# EAGLE design IVPSU (EAGLE 5.07)
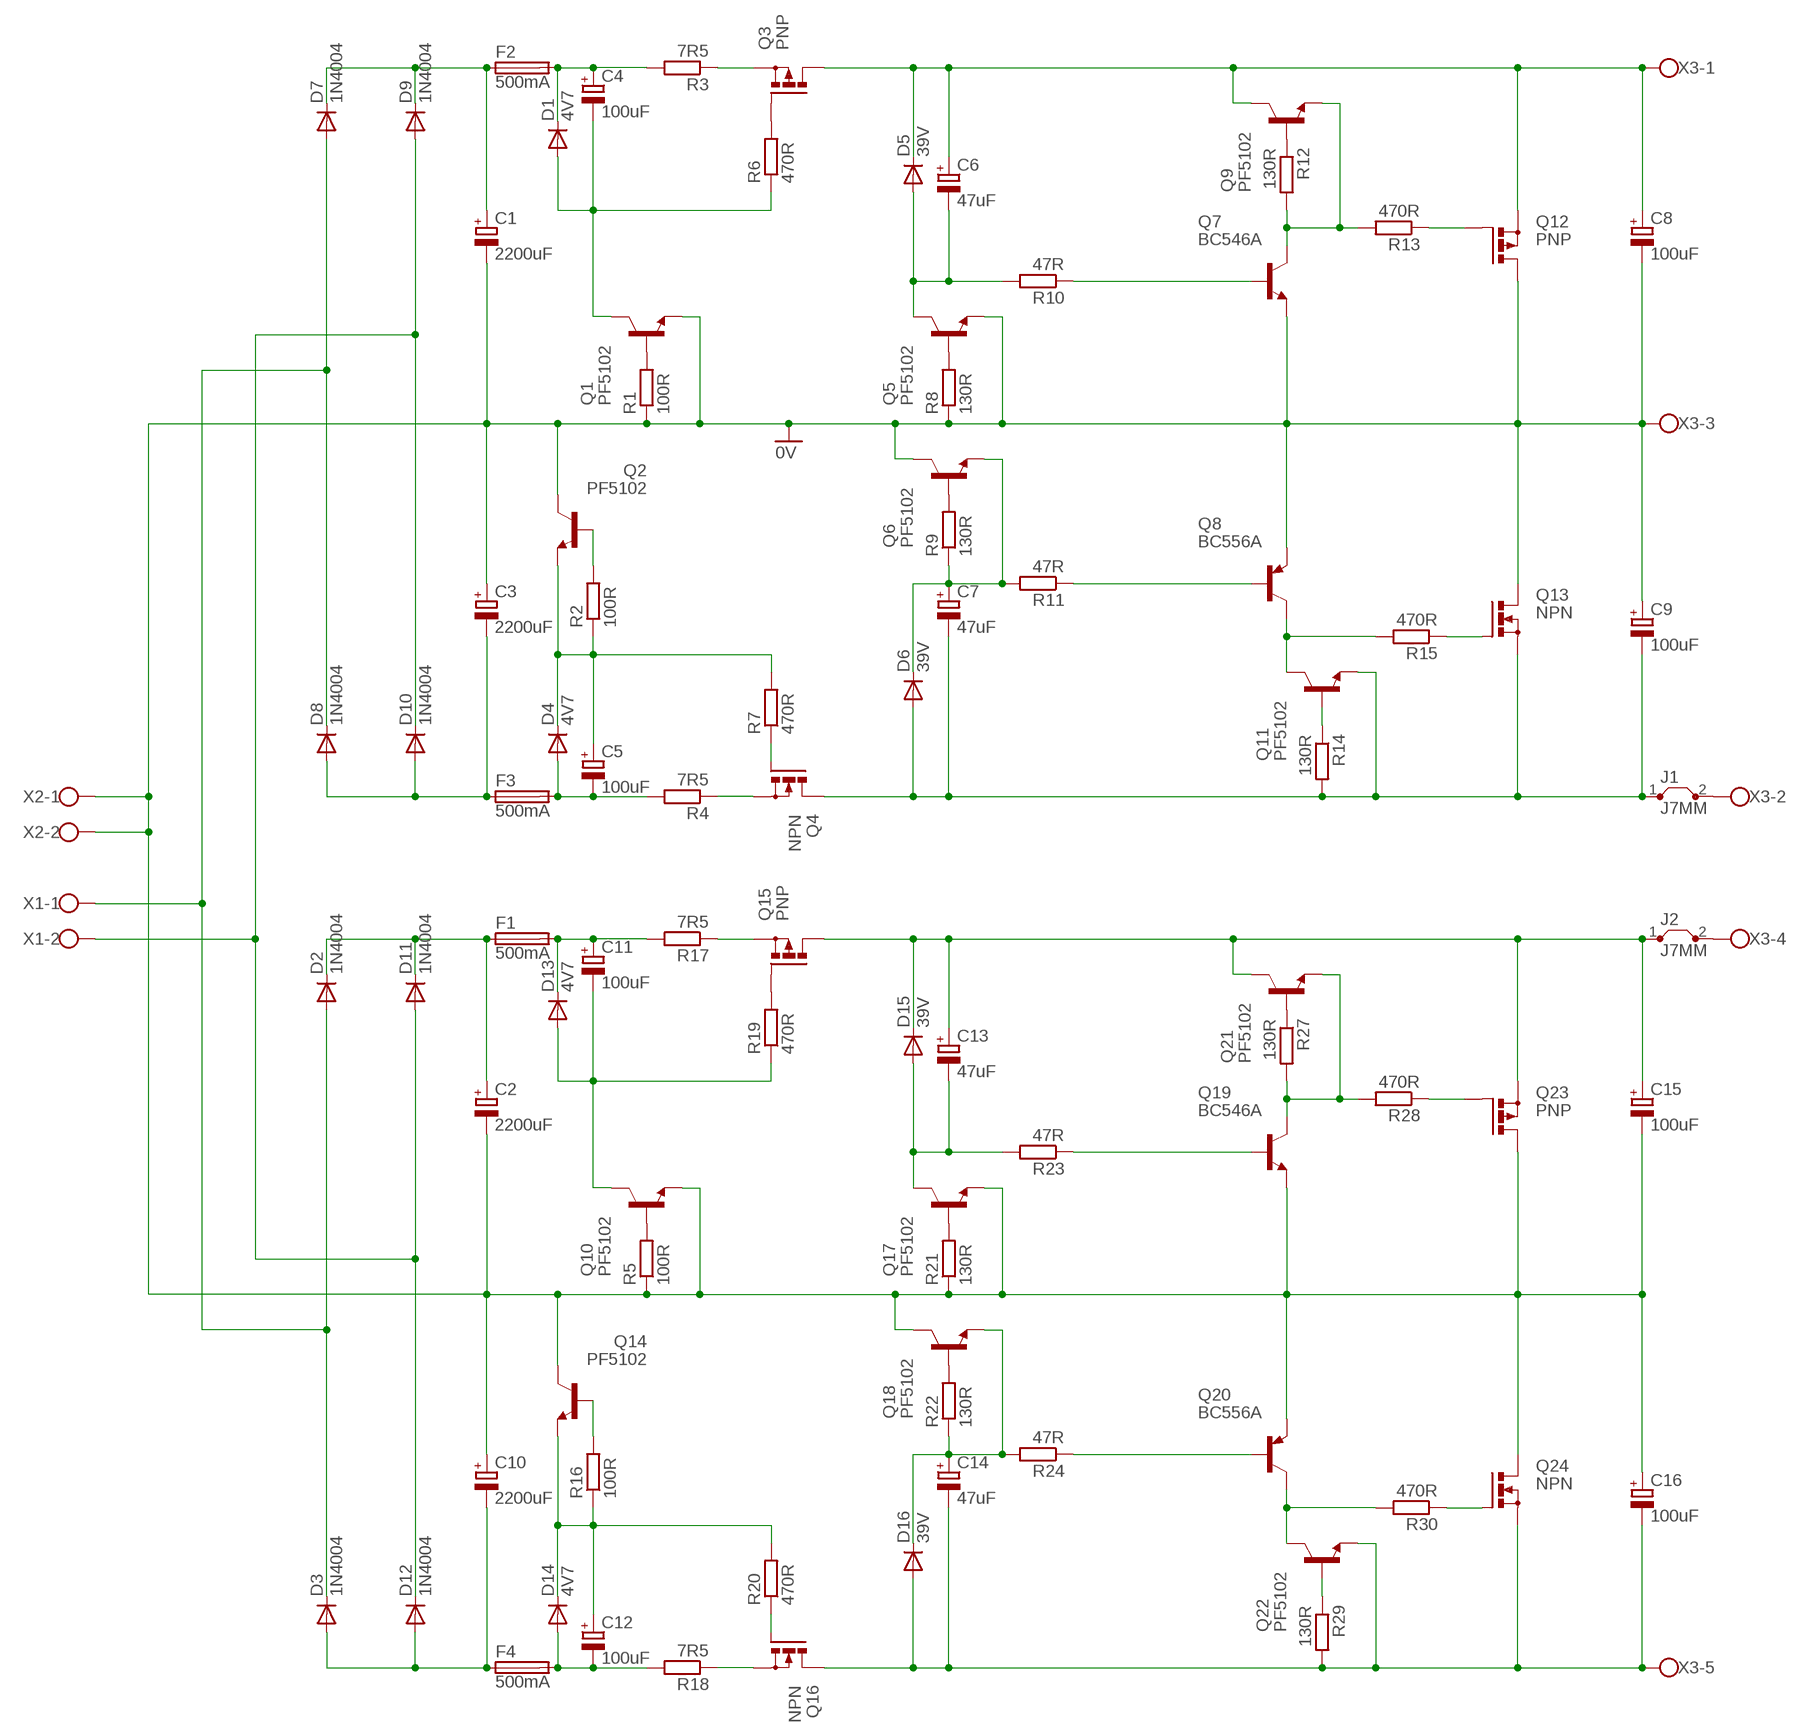
[diagram p0: schematic, sheet 1]

## Parts
C1  2200uF  CPOL-EUE7.5-18  [E7,5-18]
C2  2200uF  CPOL-EUE7.5-18  [E7,5-18]
C3  2200uF  CPOL-EUE7.5-18  [E7,5-18]
C4  100uF  CPOL-EUE3.5-8  [E3,5-8]
C5  100uF  CPOL-EUE3.5-8  [E3,5-8]
C6  47uF  CPOL-EUE3.5-8  [E3,5-8]
C7  47uF  CPOL-EUE3.5-8  [E3,5-8]
C8  100uF  CPOL-EUE5-8.5  [E5-8,5]
C9  100uF  CPOL-EUE5-8.5  [E5-8,5]
C10  2200uF  CPOL-EUE7.5-18  [E7,5-18]
C11  100uF  CPOL-EUE3.5-8  [E3,5-8]
C12  100uF  CPOL-EUE3.5-8  [E3,5-8]
C13  47uF  CPOL-EUE3.5-8  [E3,5-8]
C14  47uF  CPOL-EUE3.5-8  [E3,5-8]
C15  100uF  CPOL-EUE5-8.5  [E5-8,5]
C16  100uF  CPOL-EUE5-8.5  [E5-8,5]
D1  4V7  1N4004  [DO41-10]
D2  1N4004  [DO41-10]
D3  1N4004  [DO41-10]
D4  4V7  1N4004  [DO41-10]
D5  39V  1N4004  [DO41-10]
D6  39V  1N4004  [DO41-10]
D7  1N4004  [DO41-10]
D8  1N4004  [DO41-10]
D9  1N4004  [DO41-10]
D10  1N4004  [DO41-10]
D11  1N4004  [DO41-10]
D12  1N4004  [DO41-10]
D13  4V7  1N4004  [DO41-10]
D14  4V7  1N4004  [DO41-10]
D15  39V  1N4004  [DO41-10]
D16  39V  1N4004  [DO41-10]
F1  500mA  19560  [19560]
F2  500mA  19560  [19560]
F3  500mA  19560  [19560]
F4  500mA  19560  [19560]
J1  J7MM  [07]
J2  J7MM  [07]
Q1  PF5102  BCX59SMD  [TO92-EBC]
Q2  PF5102  BCX59SMD  [TO92-EBC]
Q3  PNP  PMOSFET_PTO220BH  [TO220BH]
Q4  NPN  PMOSFET_NTO220BH  [TO220BH]
Q5  PF5102  BCX59SMD  [TO92-EBC]
Q6  PF5102  BCX59SMD  [TO92-EBC]
Q7  BC546A  BC550B  [TO92-EBC]
Q8  BC556A  BC560  [TO92-EBC]
Q9  PF5102  BCX59SMD  [TO92-EBC]
Q10  PF5102  BCX59SMD  [TO92-EBC]
Q11  PF5102  BCX59SMD  [TO92-EBC]
Q12  PNP  PMOSFET_PTO220BH  [TO220BH]
Q13  NPN  PMOSFET_NTO220BH  [TO220BH]
Q14  PF5102  BCX59SMD  [TO92-EBC]
Q15  PNP  PMOSFET_PTO220BH  [TO220BH]
Q16  NPN  PMOSFET_NTO220BH  [TO220BH]
Q17  PF5102  BCX59SMD  [TO92-EBC]
Q18  PF5102  BCX59SMD  [TO92-EBC]
Q19  BC546A  BC550B  [TO92-EBC]
Q20  BC556A  BC560  [TO92-EBC]
Q21  PF5102  BCX59SMD  [TO92-EBC]
Q22  PF5102  BCX59SMD  [TO92-EBC]
Q23  PNP  PMOSFET_PTO220BH  [TO220BH]
Q24  NPN  PMOSFET_NTO220BH  [TO220BH]
R1  100R  R-EU_0204/7  [0204/7]
R2  100R  R-EU_0204/7  [0204/7]
R3  7R5  R-EU_0309/12  [0309/12]
R4  7R5  R-EU_0309/12  [0309/12]
R5  100R  R-EU_0204/7  [0204/7]
R6  470R  R-EU_0204/7  [0204/7]
R7  470R  R-EU_0204/7  [0204/7]
R8  130R  R-EU_0204/7  [0204/7]
R9  130R  R-EU_0204/7  [0204/7]
R10  47R  R-EU_0204/7  [0204/7]
R11  47R  R-EU_0204/7  [0204/7]
R12  130R  R-EU_0204/7  [0204/7]
R13  470R  R-EU_0204/7  [0204/7]
R14  130R  R-EU_0204/7  [0204/7]
R15  470R  R-EU_0204/7  [0204/7]
R16  100R  R-EU_0204/7  [0204/7]
R17  7R5  R-EU_0309/12  [0309/12]
R18  7R5  R-EU_0309/12  [0309/12]
R19  470R  R-EU_0204/7  [0204/7]
R20  470R  R-EU_0204/7  [0204/7]
R21  130R  R-EU_0204/7  [0204/7]
R22  130R  R-EU_0204/7  [0204/7]
R23  47R  R-EU_0204/7  [0204/7]
R24  47R  R-EU_0204/7  [0204/7]
R27  130R  R-EU_0204/7  [0204/7]
R28  470R  R-EU_0204/7  [0204/7]
R29  130R  R-EU_0204/7  [0204/7]
R30  470R  R-EU_0204/7  [0204/7]
X1  W237-02P  [W237-132]
X2  W237-02P  [W237-132]
X3  W237-05P  [W237-5P]

## Nets
0V: C1.- C2.- C3.+ C8.- C9.+ C10.+ C15.- C16.+ Q1.E Q2.C Q5.E Q6.C Q7.E Q8.E Q10.E Q12.D Q13.D Q14.C Q17.E Q18.C Q19.E Q20.E Q23.D Q24.D R1.1 R5.1 R8.1 R21.1 X2.1 X2.2 X3.3
N$1: J1.2 X3.2
N$2: D2.A D3.C D7.A D8.C X1.1
N$3: C11.- D13.A Q10.C R19.1
N$4: C2.+ D2.C D11.C F1.1
N$5: C10.- D3.A D12.A F4.1
N$6: D9.A D10.C D11.A D12.C X1.2
N$7: J2.2 X3.4
N$8: C1.+ D7.C D9.C F2.1
N$9: C5.+ D4.C Q2.E R2.1 R7.2
N$10: Q2.B R2.2
N$11: Q3.S R3.1
N$12: Q4.S R4.1
N$13: C5.- D4.A F3.2 R4.2
N$14: Q1.B R1.2
N$15: C4.+ D1.C F2.2 R3.2
N$16: Q3.G R6.2
N$17: Q4.G R7.1
N$18: C4.- D1.A Q1.C R6.1
N$19: C6.- D5.A Q5.C R10.2
N$20: C7.+ D6.C Q6.E R9.1 R11.2
N$21: Q5.B R8.2
N$22: Q6.B R9.2
N$23: C7.- C9.- D6.A J1.1 Q4.D Q11.E Q13.S R14.2
N$24: Q8.C Q11.C R15.2
N$25: Q12.G R13.1
N$26: C6.+ C8.+ D5.C Q3.D Q9.C Q12.S X3.1
N$27: C14.- C16.- D16.A Q16.D Q22.E Q24.S R29.2 X3.5
N$28: C12.+ D14.C Q14.E R16.1 R20.2
N$29: Q14.B R16.2
N$30: Q9.B R12.1
N$31: Q7.C Q9.E R12.2 R13.2
N$32: Q11.B R14.1
N$34: Q15.S R17.1
N$35: Q16.S R18.1
N$36: C13.- D15.A Q17.C R23.2
N$37: C12.- D14.A F4.2 R18.2
N$38: Q19.B R23.1
N$39: Q10.B R5.2
N$40: C11.+ D13.C F1.2 R17.2
N$41: C14.+ D16.C Q18.E R22.1 R24.2
N$42: Q20.B R24.1
N$43: Q7.B R10.1
N$44: Q24.G R30.1
N$45: Q15.G R19.2
N$46: Q16.G R20.1
N$47: Q8.B R11.1
N$48: Q17.B R21.2
N$49: Q18.B R22.2
N$50: Q13.G R15.1
N$51: Q20.C Q22.C R30.2
N$52: Q23.G R28.1
N$53: C13.+ C15.+ D15.C J2.1 Q15.D Q21.C Q23.S
N$54: Q21.B R27.1
N$55: Q19.C Q21.E R27.2 R28.2
N$56: Q22.B R29.1
N$60: C3.- D8.A D10.A F3.1

## Library data of the parts
C1-C16 = resistor:CPOL-EU: POLARIZED CAPACITOR, European symbol
D1-D16 = diode:1N4004: DIODE general purpose rectifier, 1 A
F1-F4 = fuse:19560: FUSE HOLDER TR5, Wickmann
J1 J2 = jumper:J: Bridge
Q1 Q2 Q5 Q6 Q9-Q11 Q14 Q17 Q18 Q21 Q22 = transistor-npn:BCX59*: NPN Transistor
Q3 Q12 Q15 Q23 = transistor-power:PMOSFET_P: Power MOSFET P-Channel
Q4 Q13 Q16 Q24 = transistor-power:PMOSFET_N: Power MOSFET N-Channel
Q7 Q19 = transistor-npn:BC550*: NPN Transistor
Q8 Q20 = transistor-pnp:BC560*: PNP Transistror
R1-R24 R27-R30 = resistor:R-EU_: RESISTOR, European symbol
X1 X2 = con-wago-508:W237-02P: WAGO SREW CLAMP
X3 = con-wago-508:W237-05P: WAGO SREW CLAMP

## Board
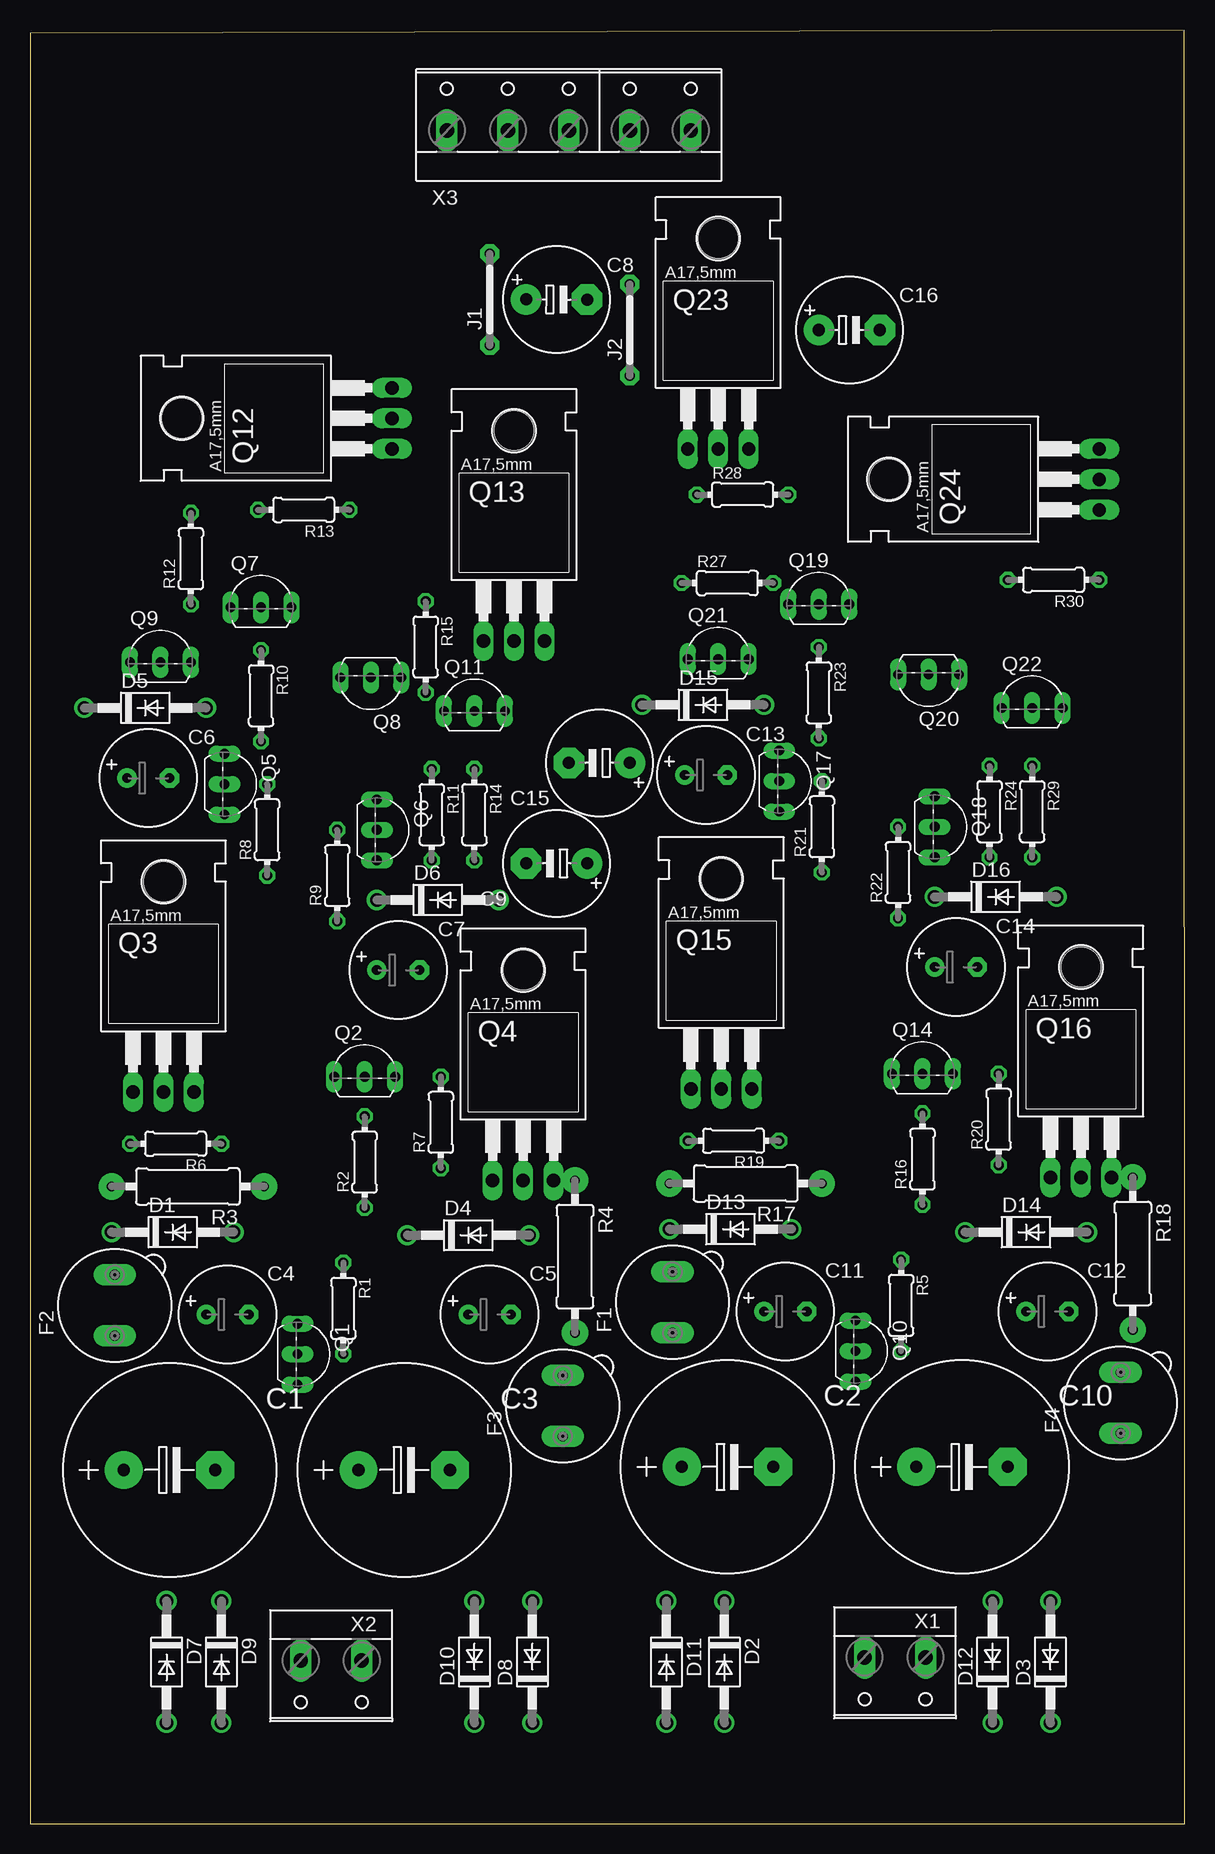
[diagram p1: board, top side]
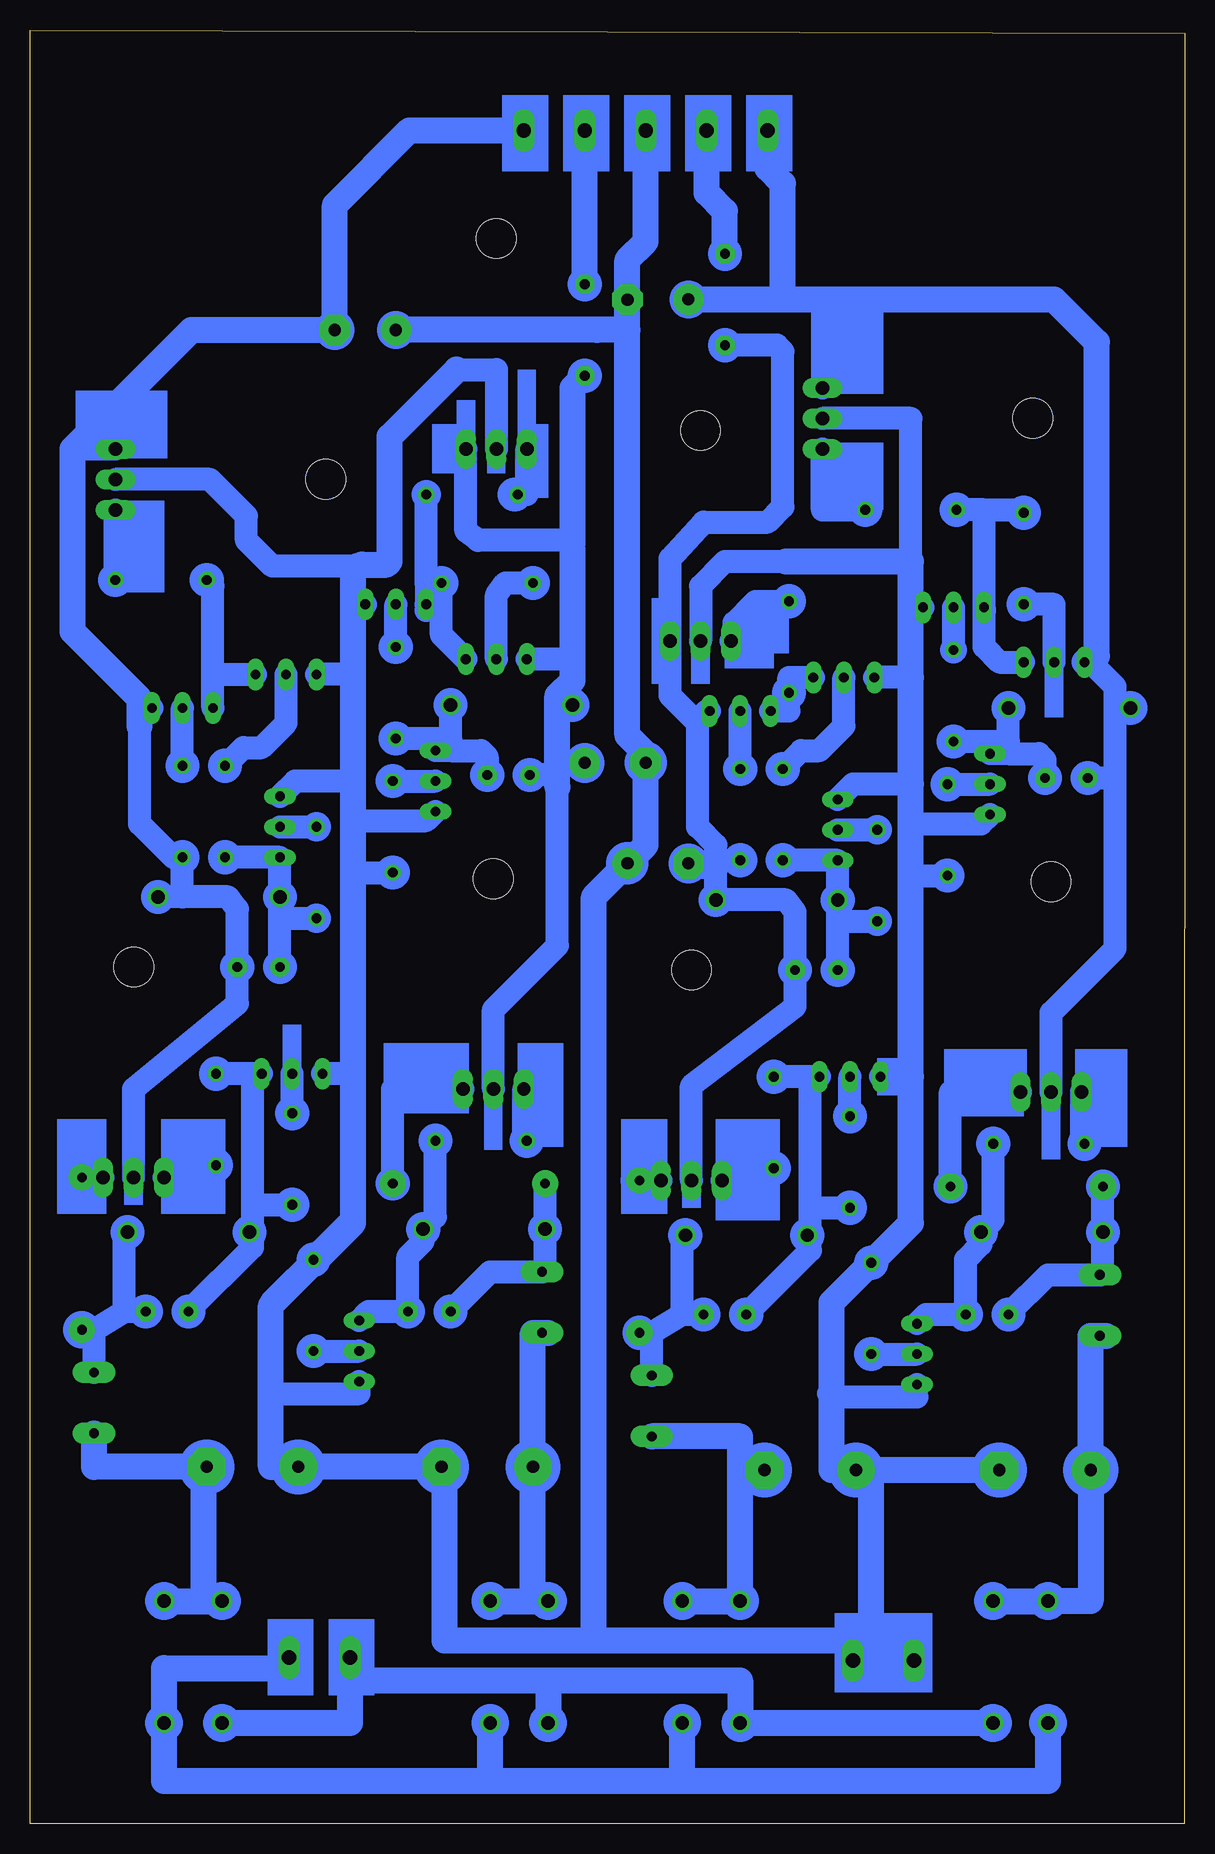
[diagram p2: board, bottom side, seen from below]

Size 96.22 x 149.46 mm. Coordinates in mm from the lower left corner, seen from the top.
Outline: 96.22,0 96.19,149.46 0,149.21 0.03,0 96.22,0
Copper layers (1*16): Top 0.035mm / dielectric 1.5mm / Bottom 0.035mm
Design rules "default": minimum track width 10mil, minimum drill 24mil, track to track 8mil, track to pad 8mil, pad to pad 8mil, via to via 8mil, smd to smd 8mil, copper to edge 40mil, drill to drill 8mil, minimum pad ring 10mil, minimum via ring 8mil, stop-mask expansion 4mil, vias tented up to drill 0mil, thermal gap 10mil

### Footprints (pad centres in the part's own frame; a part is rotated, then mirrored left to right if it is on the bottom)
E7,5-18 = drill 1.016 pad 3.15 round: + -3.81,0 | drill 1.016 pad 3.15 octagon: - 3.81,0
E3,5-8 = drill 0.813 pad 1.6 round: + -1.778,0 | drill 0.813 pad 1.6 octagon: - 1.778,0
E5-8,5 = drill 1.016 pad 2.54 round: + -2.54,0 | drill 1.016 pad 2.54 octagon: - 2.54,0
DO41-10 = drill 1.118 round: A 5.08,0; C -5.08,0
19560 = drill 0.813 pad 1.778 long: 1 -2.54,0; 2 2.54,0
07 = drill 0.813 pad 1.6 octagon: 1 -3.81,0; 2 3.81,0
TO92-EBC = drill 0.813 long: B 0,-1.27; C -2.54,-1.27; E 2.54,-1.27
TO220BH = drill 1.118 long: D 0,-6.35; G -2.54,-6.35; S 2.54,-6.35 | hole 3.302: 0,11.176
0204/7 = drill 0.813 octagon: 1 -3.81,0; 2 3.81,0
0309/12 = drill 0.8 pad 2.184 round: 1 -6.35,0; 2 6.35,0
W237-132 = drill 1.194 long: 1 -2.54,-0.635; 2 2.54,-0.635
W237-5P = drill 1.194 long: 1 -10.16,-0.635; 2 -5.08,-0.635; 3 0,-0.635; 4 5.08,-0.635; 5 10.16,-0.635

### Placement (x,y rotation side)
C1  11.63,29.46 0 top
C2  58.12,29.72 0 top
C3  31.19,29.46 0 top
C4  16.46,42.42 0 top
C5  38.3,42.42 0 top
C6  9.86,87.12 0 top
C7  30.68,71.12 0 top
C8  43.89,127 359.7 top
C9  43.89,80.01 180 top
C10  77.67,29.72 0 top
C11  62.94,42.67 0 top
C12  84.79,42.67 0 top
C13  56.34,87.38 0 top
C14  77.17,71.37 0 top
C15  47.45,88.39 180 top
C16  68.28,124.46 0 top
D1  11.89,49.28 0 top
D2  57.86,13.46 270 top
D3  85.04,13.46 90 top
D4  36.53,49.02 0 top
D5  9.6,92.96 0 top
D6  33.99,76.96 0 top
D7  11.38,13.46 270 top
D8  41.86,13.46 90 top
D9  15.95,13.46 270 top
D10  37.03,13.46 90 top
D11  53.04,13.46 270 top
D12  80.21,13.46 90 top
D13  58.37,49.53 0 top
D14  83.01,49.28 0 top
D15  56.08,93.22 0 top
D16  80.47,77.22 0 top
F1  53.54,43.43 90 top
F2  7.06,43.18 90 top
F3  44.4,34.8 90 top
F4  90.88,35.05 90 top
J1  38.3,127 90 top
J2  49.99,124.46 90 top
Q1  23.57,39.12 270 top
Q2  27.89,63.5 0 top
Q3  11.13,67.31 0 top
Q4  41.1,59.94 0 top
Q5  17.48,86.61 270 top
Q6  30.18,82.8 270 top
Q7  19.25,102.62 0 top
Q8  28.4,94.23 180 top
Q9  10.87,98.04 0 top
Q10  70.05,39.37 270 top
Q11  37.03,93.98 0 top
Q12  23.83,117.09 90 top
Q13  40.34,104.9 0 top
Q14  74.37,63.75 0 top
Q15  57.61,67.56 0 top
Q16  87.58,60.2 0 top
Q17  63.7,86.87 270 top
Q18  76.66,83.06 270 top
Q19  65.74,102.87 0 top
Q20  74.88,94.49 180 top
Q21  57.35,98.3 0 top
Q22  83.52,94.23 0 top
Q23  57.35,120.9 0 top
Q24  82.75,112.01 90 top
R1  26.11,42.93 270 top
R2  27.89,55.12 90 top
R3  13.16,53.09 180 top
R4  45.42,47.24 270 top
R5  72.59,43.18 270 top
R6  12.14,56.64 180 top
R7  34.24,58.42 90 top
R8  19.76,82.8 90 top
R9  25.6,78.99 90 top
R10  19.25,93.98 270 top
R11  33.48,84.07 270 top
R12  13.41,105.41 90 top
R13  22.81,109.47 180 top
R14  37.03,84.07 270 top
R15  32.97,98.04 270 top
R16  74.37,55.37 90 top
R17  59.64,53.34 180 top
R18  91.9,47.5 270 top
R19  58.62,56.9 180 top
R20  80.72,58.67 90 top
R21  65.99,83.06 90 top
R22  72.34,79.25 90 top
R23  65.74,94.23 270 top
R24  79.96,84.33 270 top
R27  58.12,103.38 0 top
R28  59.39,110.74 0 top
R29  83.52,84.33 270 top
R30  85.29,103.63 180 top
X1  72.09,13.21 180 top
X2  25.1,12.95 180 top
X3  44.91,141.73 0 top

### Tracks (layer width: path | path; a pad name or v marks a point on that pad's centre or on a via)
0V
  Bottom 1.93: 69.29,62.48 Q14.C | 69.29,79.25 R21.1 | Q18.C 74.12,86.87 69.29,86.87 | 69.29,95.76 Q20.E | 69.29,101.6 Q19.E | Q23.D 57.35,121.16 60.66,121.16 | 22.81,62.23 Q2.C | 22.81,78.99 R8.1 | Q6.C 27.64,86.61 22.81,86.61 | 22.81,95.5 Q8.E | 22.81,101.35 Q7.E | Q13.D 40.34,103.12 38.3,105.16 33.22,105.16 | Q10.E 68.78,35.81 76.15,35.81 | 76.15,43.18 76.15,43.43 71.96,47.63 | Q1.E 22.3,35.56 29.41,35.56 29.67,35.81 | 22.81,105.16 22.81,117.09 Q12.D | Q24.D 81.23,112.01 78.18,108.97 78.18,106.93 76.02,104.78 68.91,104.78 | Q5.E 16.97,83.31 22.81,83.31 | Q17.E 63.2,83.57 69.29,83.57
  Bottom 2.184: C10.+ C2.- 61.67,29.72 61.67,15.24 49.23,15.24 | C10.+ 74.12,29.72 | R5.1 71.96,47.63 69.29,50.29 69.29,62.48 69.29,79.25 69.29,83.57 69.29,86.87 69.29,95.76 69.29,101.6 69.29,104.14 68.91,104.78 68.53,104.9 66.5,104.9 66.24,105.16 66.24,115.57 60.66,121.16 | 26.11,29.46 C3.+ | 26.11,29.46 C1.- | C3.+ 27.64,29.46 | 33.22,105.16 22.81,105.16 22.81,101.35 22.81,95.5 22.81,86.61 22.81,83.31 22.81,78.99 22.81,62.23 22.81,50.04 R1.1 29.41,43.43 29.41,35.56 29.41,29.46 C3.+ | X2.1 X2.2 | X2.1 27.64,13.72 26.11,13.72 26.11,15.24 | X2.1 27.64,15.24 | 27.64,15.24 26.11,15.24 | 27.64,15.24 49.23,15.24 | 69.29,50.04 76.15,43.18 76.15,35.81 76.15,29.72 C10.+ | 49.23,15.24 49.23,77.22 C9.+ 44.91,81.53 C15.- 44.91,89.15 46.43,90.68 46.43,124.46 | 65.72,124.45 C16.+ | 48.97,124.46 65.72,124.45 | 46.43,124.46 48.97,124.46 | 46.43,124.46 C8.- 46.43,130.3 44.91,131.83 X3.3 | 65.72,124.45 65.71,124.46 48.97,124.46 | 26.11,15.24 26.11,29.46
N$1
  Bottom 2.184: J1.2 38.3,134.37 39.83,135.89 X3.2
N$2
  Bottom 2.184: 41.86,3.56 11.38,3.56 D7.A | 57.86,3.56 D2.A | 57.86,3.56 85.04,3.56 D3.C 85.04,12.95 74.63,12.95 X1.1 74.63,15.24 | 41.86,3.56 D8.C | 57.86,3.56 41.86,3.56
N$3
  Bottom 1.93: Q10.C 68.02,42.67 C11.- 64.72,47.24 63.45,48.51 D13.A 62.43,50.55 R19.1
N$4
  Bottom 2.184: D2.C 54.31,18.54 | 54.31,18.54 D11.C | 53.04,40.89 F1.1 54.31,40.89 C2.+ 54.31,18.54
N$5
  Bottom 2.184: D3.A 81.74,18.54 | 81.74,18.54 D12.A | F4.1 90.88,29.72 C10.- 81.74,29.46 81.74,18.54
N$6
  Bottom 2.184: 53.04,11.94 D11.A | 69.55,11.94 53.04,11.94 | 69.55,11.94 X1.2 | 69.55,11.94 69.55,8.38 D12.C | 53.04,11.94 37.03,11.94 D10.C D9.A
N$7
  Bottom 2.184: J2.2 X3.4
N$8
  Bottom 2.184: 6.55,40.64 F2.1 7.82,40.64 C1.+ 7.82,18.54 D7.C D9.C
N$9
  Bottom 1.93: 31.19,49.02 31.19,51.31 | 31.19,49.02 D4.C | 31.19,51.31 R2.1 | 31.19,51.31 31.19,62.23 | 31.19,62.23 Q2.E | 31.19,62.23 R7.2 | C5.+ 31.19,47.75 31.19,49.02
N$10
  Bottom 1.93: R2.2 Q2.B
N$11
  Bottom 1.93: R3.1 19.51,60.96 Q3.S
N$12
  Bottom 1.93: Q4.S R4.1
N$13
  Bottom 1.93: F3.2 44.4,40.89 | 44.4,40.89 41.86,42.42 | 41.86,42.42 41.86,49.02 D4.A | 41.86,42.42 C5.- | 44.4,40.89 R4.2
N$14
  Bottom 1.93: R1.2 Q1.B
N$15
  Bottom 1.93: C4.+ 11.38,45.72 F2.2 6.81,45.97 D1.C R3.2
N$16
  Bottom 1.93: R6.2 8.59,56.9 Q3.G
N$17
  Bottom 1.93: R7.1 35.26,53.59 Q4.G
N$18
  Bottom 1.93: Q1.C 21.54,42.42 C4.- 18.24,46.99 16.97,48.26 D1.A 15.95,50.29 R6.1
N$19
  Bottom 1.93: C6.- 11.63,88.65 12.14,89.15 14.68,89.15 | 14.68,89.15 Q5.C | 14.68,90.17 14.68,89.15 | 14.68,90.17 D5.A | R10.2 14.68,90.17
N$20
  Bottom 1.93: C7.+ 28.91,75.18 | 28.91,75.18 D6.C Q6.E R11.2 | 28.91,75.18 R9.1
N$21
  Bottom 1.93: R8.2 Q5.B
N$22
  Bottom 1.93: Q6.B R9.2
N$23
  Bottom 1.93: Q4.D 41.1,61.47 32.46,68.07 C7.- 32.46,75.95 33.22,76.96 D6.A 39.07,79.76 39.07,80.26 | 40.59,91.69 40.59,91.95 39.83,92.71 Q11.E | 40.59,91.69 42.88,93.98 Q13.S 42.88,105.41 40.08,108.46 34.75,108.46 33.48,109.73 33.48,122.68 33.99,123.19 J1.1 | 40.59,91.69 40.59,83.06 39.07,81.53 39.07,80.26 | 37.8,80.26 R14.2 39.07,80.26 | C9.- 41.1,80.01
  Bottom 2.184: C9.- 41.1,79.76 39.07,79.76
N$24
  Bottom 1.93: Q11.C 32.97,92.71 R15.2 32.97,95.5 Q8.C
N$25
  Bottom 1.93: R13.1 30.18,109.47 Q12.G
N$26
  Bottom 1.93: Q3.D 11.13,67.56 5.79,72.9 5.79,87.12 | 5.79,87.12 5.79,92.96 | 5.79,92.96 D5.C | 5.79,87.12 C6.+ | 30.18,127 Q12.S | 7.82,96.77 5.79,94.74 5.79,92.96
  Bottom 2.184: Q9.C 7.82,96.77 7.32,97.28 7.32,123.44 10.87,127 30.18,127 33.48,127 | C8.+ 41.08,127 33.48,127 | X3.1 34.75,137.92 33.48,136.65 33.48,127
N$27
  Bottom 1.93: Q16.D 87.58,61.21 78.94,68.33 C14.- 78.94,76.2 79.71,77.22 83.52,77.22 | 83.52,77.22 D16.A | 83.52,77.22 R29.2 84.28,80.52 87.07,83.31 87.07,91.44 87.07,92.2 86.31,92.96 Q22.E | 92.66,114.55 Q24.S
  Bottom 2.184: 87.07,91.44 87.07,93.73 92.66,99.31 92.66,114.55 82.75,124.46 C16.- 70.82,134.87 64.59,141.1 X3.5
N$28
  Bottom 1.93: 77.67,49.28 77.67,51.56 | 77.67,49.28 D14.C | 77.67,51.56 R16.1 | 77.67,51.56 77.67,62.48 | 77.67,62.48 Q14.E | 77.67,62.48 R20.2 | C12.+ 77.67,48.01 77.67,49.28
N$29
  Bottom 1.93: R16.2 Q14.B
N$30
  Bottom 1.93: Q9.B 10.87,101.6 R12.1
N$31
  Bottom 1.93: 16.71,109.47 R13.2 | Q7.C 16.71,109.47 | Q7.C 16.71,100.84 | Q9.E 15.44,96.77 16.71,98.04 Q7.C | R12.2 13.67,109.47 16.71,109.47
N$32
  Bottom 1.93: R14.1 Q11.B
N$34
  Bottom 1.93: R17.1 65.99,61.21 Q15.S
N$35
  Bottom 1.93: R18.1 Q16.S
N$36
  Bottom 1.93: C13.- 58.12,88.9 58.62,89.41 61.16,89.41 | 61.16,89.41 Q17.C | 61.16,90.42 61.16,89.41 | 61.16,90.42 D15.A | R23.2 61.16,90.42
N$37
  Bottom 1.93: F4.2 90.88,41.15 | 90.88,41.15 88.34,42.67 | 88.34,42.67 88.34,49.28 D14.A | 88.34,42.67 C12.- | 90.88,41.15 R18.2
N$38
  Bottom 1.93: R23.1 Q19.B
N$39
  Bottom 1.93: R5.2 Q10.B
N$40
  Bottom 1.93: C11.+ 57.86,45.97 F1.2 53.29,46.23 D13.C R17.2
N$41
  Bottom 1.93: C14.+ 75.39,75.44 | 75.39,75.44 D16.C Q18.E R24.2 | 75.39,75.44 R22.1
N$42
  Bottom 1.93: R24.1 78.44,89.66 76.91,89.66 74.88,91.69 Q20.B
N$43
  Bottom 1.93: R10.1 Q7.B
N$44
  Bottom 1.93: R30.1 Q24.G
N$45
  Bottom 1.93: R19.2 55.07,57.15 Q15.G
N$46
  Bottom 1.93: R20.1 81.74,53.85 Q16.G
N$47
  Bottom 1.93: R11.1 31.95,89.41 30.43,89.41 28.4,91.44 Q8.B
N$48
  Bottom 1.93: R21.2 Q17.B
N$49
  Bottom 1.93: Q18.B R22.2
N$50
  Bottom 1.93: Q13.G 37.54,98.81 37.54,100.08 35.76,101.85 R15.1
N$51
  Bottom 1.93: 80.98,95.76 Q20.C | Q22.C 80.98,95.76 | R30.2 80.98,103.12 80.98,95.76
N$52
  Bottom 1.93: Q23.G 54.81,110.74 R28.1
N$53
  Bottom 1.93: Q15.D 57.61,67.82 52.27,73.15 52.27,86.36 52.27,87.38 | 52.27,87.38 52.27,88.39 52.27,93.22 | 52.27,87.38 C13.+ | Q23.S 59.89,107.7 58.88,106.93 51,106.93 51,106.68 51,106.17 | 51,97.03 Q21.C
  Bottom 2.184: 52.27,88.39 C15.+ | 52.27,86.36 52.27,93.22 | 52.27,93.22 52.27,93.98 51,95.25 51,97.03 51,106.17 | 52.27,93.22 D15.C | J2.1 51,119.63 51,106.68
N$54
  Bottom 1.93: Q21.B 57.35,102.36 56.59,103.38 R27.1
N$55
  Bottom 1.93: 63.2,103.38 Q19.C 63.2,101.09 | 63.2,103.38 R28.2 | 63.2,103.38 R27.2 61.93,99.06 Q21.E
N$56
  Bottom 1.93: R29.1 Q22.B
N$60
  Bottom 2.184: 37.03,29.46 C3.- | D8.A D10.A 37.03,29.46 | 37.03,29.46 37.03,32.26 F3.1
(copper drawn outside any net)
  shapes: Bottom area x50, Bottom circle x140